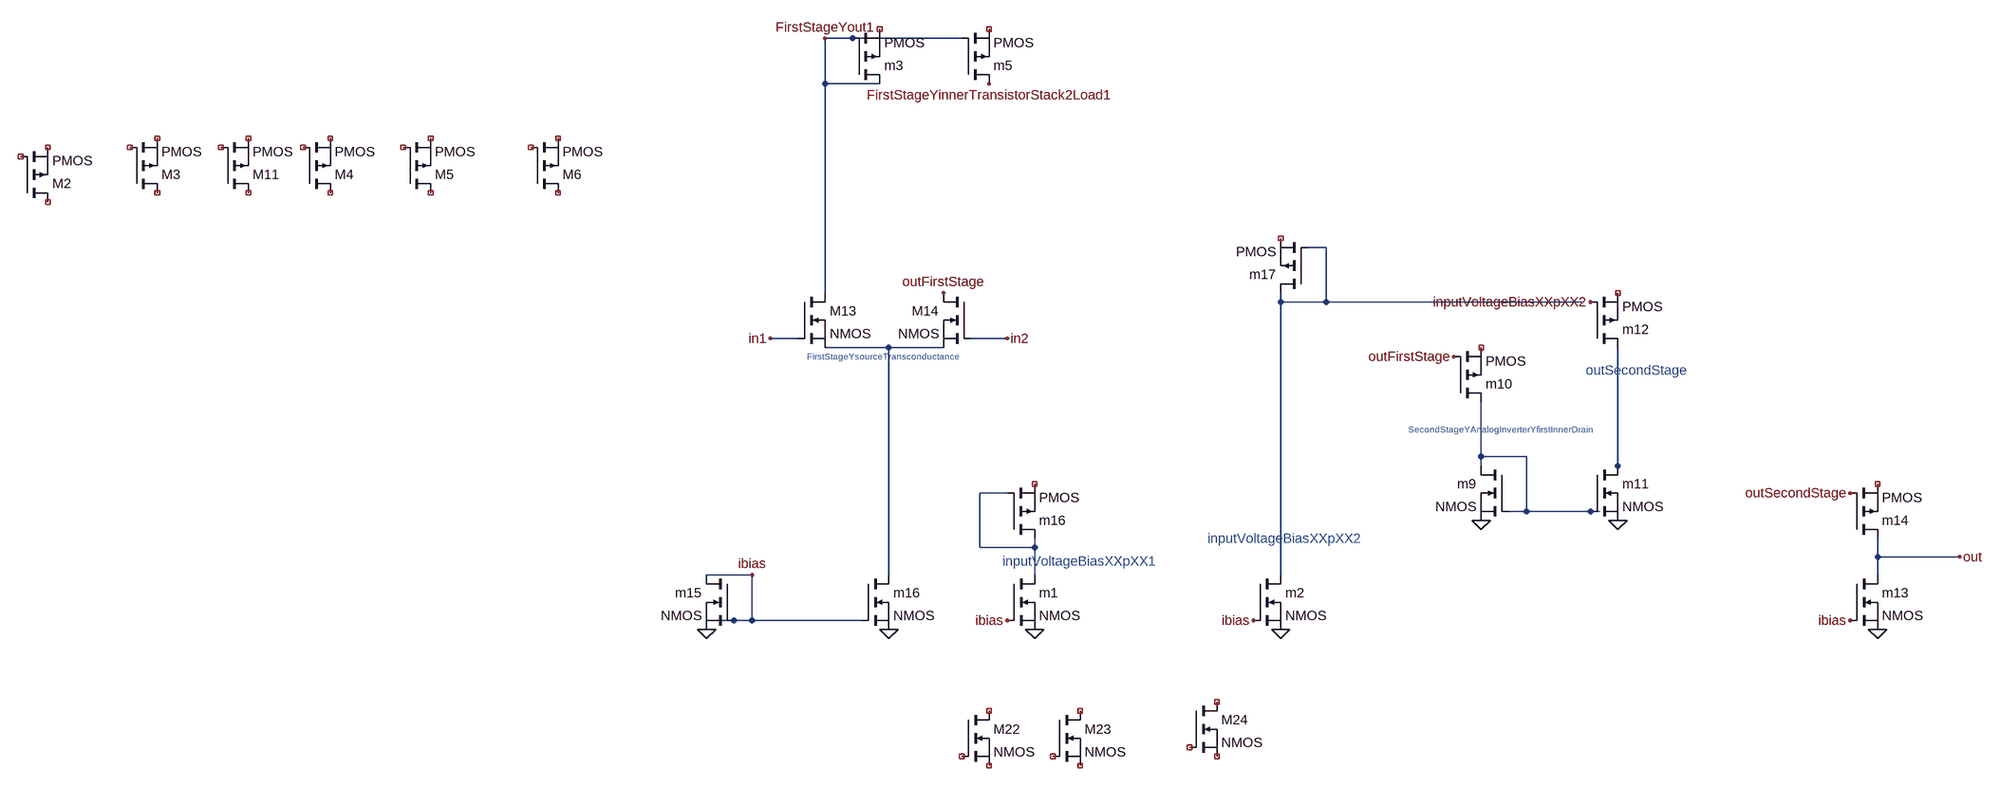
[diagram p0: schematic schematic_1.asc]
schematic_1.asc, the LTspice schematic file:
Version 4
SHEET 1 3804 1208
WIRE 1520 -272 1472 -272
WIRE 1712 -272 1520 -272
WIRE 1472 -192 1472 -272
WIRE 1568 -192 1472 -192
WIRE 2352 96 2320 96
WIRE 1472 176 1472 -192
WIRE 2272 192 2272 176
WIRE 2352 192 2352 96
WIRE 2352 192 2272 192
WIRE 2800 192 2352 192
WIRE 1424 256 1376 256
WIRE 1792 256 1728 256
WIRE 1584 272 1472 272
WIRE 1680 272 1584 272
WIRE 2624 464 2624 368
WIRE 2704 464 2624 464
WIRE 2624 480 2624 464
WIRE 2864 480 2864 272
WIRE 2864 496 2864 480
WIRE 1792 528 1744 528
WIRE 2704 560 2704 464
WIRE 2704 560 2672 560
WIRE 2816 560 2704 560
WIRE 2832 560 2816 560
WIRE 1744 624 1744 528
WIRE 1840 624 1840 608
WIRE 1840 624 1744 624
WIRE 3360 640 3360 608
WIRE 3504 640 3360 640
WIRE 1344 672 1264 672
WIRE 1584 672 1584 272
WIRE 1840 672 1840 624
WIRE 2272 672 2272 192
WIRE 3360 672 3360 640
WIRE 1312 752 1264 752
WIRE 1344 752 1344 672
WIRE 1344 752 1312 752
WIRE 1536 752 1344 752
FLAG 3312 752 ibias
FLAG 3312 528 outSecondStage
FLAG 3504 640 out
FLAG 3360 768 0
FLAG 2816 192 inputVoltageBiasXXpXX2
FLAG 1376 256 in1
FLAG 1792 256 in2
FLAG 1680 176 outFirstStage
FLAG 2624 576 0
FLAG 2576 288 outFirstStage
FLAG 1792 752 ibias
FLAG 1840 768 0
FLAG 2272 768 0
FLAG 2224 752 ibias
FLAG 1472 -272 FirstStageYout1
FLAG 1760 -192 FirstStageYinnerTransistorStack2Load1
FLAG 2864 576 0
FLAG 1344 672 ibias
FLAG 1264 768 0
FLAG 1584 768 0
SYMBOL pmos 3312 608 M180
SYMATTR InstName m14
SYMBOL pmos -64 16 M180
SYMATTR InstName M2
SYMBOL pmos 128 0 M180
SYMATTR InstName M3
SYMBOL pmos 432 0 M180
SYMATTR InstName M4
SYMBOL pmos 608 0 M180
SYMATTR InstName M5
SYMBOL pmos 832 0 M180
SYMATTR InstName M6
SYMBOL pmos 1520 -192 M180
SYMATTR InstName m3
SYMBOL pmos 1712 -192 M180
SYMATTR InstName m5
SYMBOL pmos 2320 176 R180
SYMATTR InstName m17
SYMBOL pmos 2576 368 M180
SYMATTR InstName m10
SYMBOL pmos 288 0 M180
SYMATTR InstName M11
SYMBOL nmos 3312 672 R0
SYMATTR InstName m13
SYMBOL nmos 1424 176 R0
SYMATTR InstName M13
SYMBOL nmos 1728 176 M0
SYMATTR InstName M14
SYMBOL nmos 2672 480 M0
SYMATTR InstName m9
SYMBOL nmos 2816 480 R0
SYMATTR InstName m11
SYMBOL nmos 1312 672 M0
SYMATTR InstName m15
SYMBOL nmos 1536 672 R0
SYMATTR InstName m16
SYMBOL nmos 1712 1088 R0
SYMATTR InstName M22
SYMBOL nmos 1872 1088 R0
SYMATTR InstName M23
SYMBOL nmos 2112 1072 R0
SYMATTR InstName M24
SYMBOL nmos 2224 672 R0
SYMATTR InstName m2
SYMBOL pmos 2816 272 M180
SYMATTR InstName m12
SYMBOL pmos 1792 608 M180
SYMATTR InstName m16
SYMBOL nmos 1792 672 R0
SYMATTR InstName m1
TEXT 2808 312 Left 2 ;outSecondStage
TEXT 1440 288 Left 1 ;FirstStageYsourceTransconductance
TEXT 2496 416 Left 1 ;SecondStageYAnalogInverterYfirstInnerDrain
TEXT 1784 648 Left 2 ;inputVoltageBiasXXpXX1
TEXT 2144 608 Left 2 ;inputVoltageBiasXXpXX2

The netlist it stands for:
* schematic_1.asc
m14 out outSecondStage NC_01 NC_01 PMOS
M2 NC_02 NC_03 NC_04 NC_04 PMOS
M3 NC_05 NC_06 NC_07 NC_07 PMOS
M4 NC_08 NC_09 NC_10 NC_10 PMOS
M5 NC_11 NC_12 NC_13 NC_13 PMOS
M6 NC_14 NC_15 NC_16 NC_16 PMOS
m3 FirstStageYout1 FirstStageYout1 NC_17 NC_17 PMOS
m5 FirstStageYinnerTransistorStack2Load1 FirstStageYout1 NC_18 NC_18 PMOS
m17 N001 N001 NC_19 NC_19 PMOS
m10 N003 outFirstStage NC_20 NC_20 PMOS
M11 NC_21 NC_22 NC_23 NC_23 PMOS
m13 out ibias 0 0 NMOS
M13 FirstStageYout1 in1 N002 N002 NMOS
M14 outFirstStage in2 N002 N002 NMOS
m9 N003 N003 0 0 NMOS
m11 N004 N003 0 0 NMOS
m15 ibias ibias 0 0 NMOS
m16 N002 ibias 0 0 NMOS
M22 NC_24 NC_25 NC_26 NC_26 NMOS
M23 NC_27 NC_28 NC_29 NC_29 NMOS
M24 NC_30 NC_31 NC_32 NC_32 NMOS
m2 N001 ibias 0 0 NMOS
m12 N004 inputVoltageBiasXXpXX2 NC_33 NC_33 PMOS
m16 N005 N005 NC_34 NC_34 PMOS
m1 N005 ibias 0 0 NMOS
.model NMOS NMOS
.model PMOS PMOS
.lib standard.mos
* outSecondStage
* FirstStageYsourceTransconductance
* SecondStageYAnalogInverterYfirstInnerDrain
* inputVoltageBiasXXpXX1
* inputVoltageBiasXXpXX2
.backanno
.end